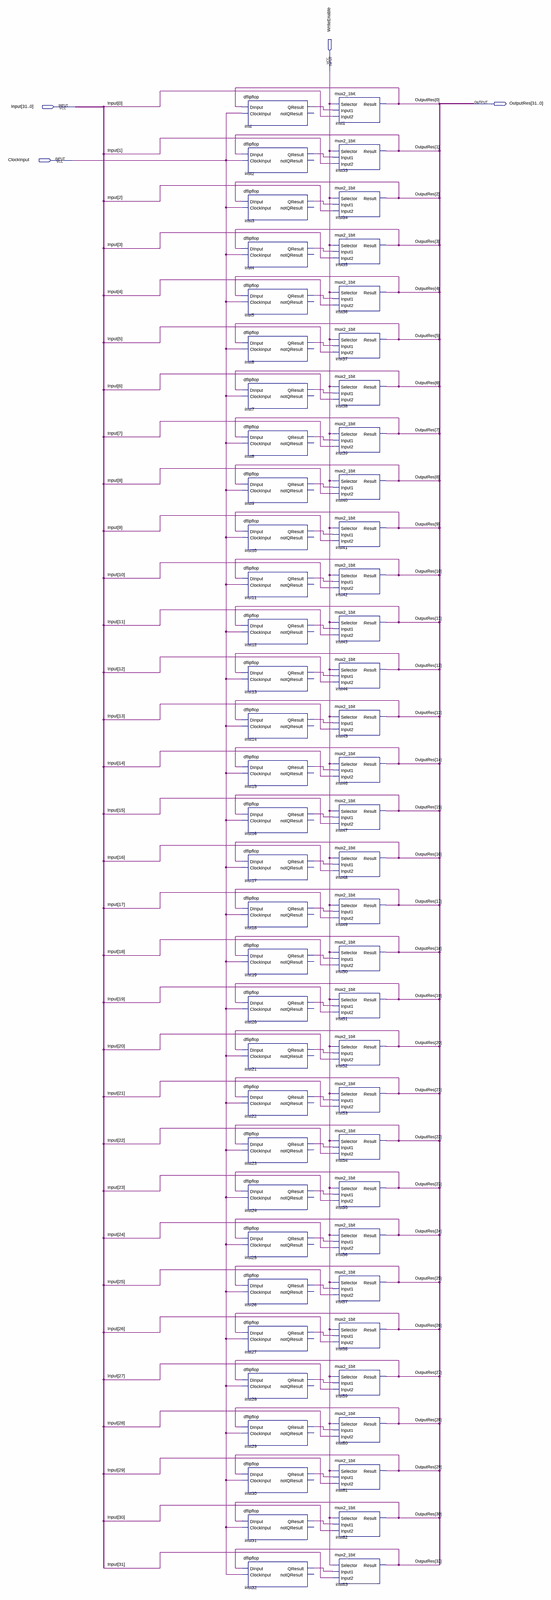
[diagram p0: schematic sheet, whole]
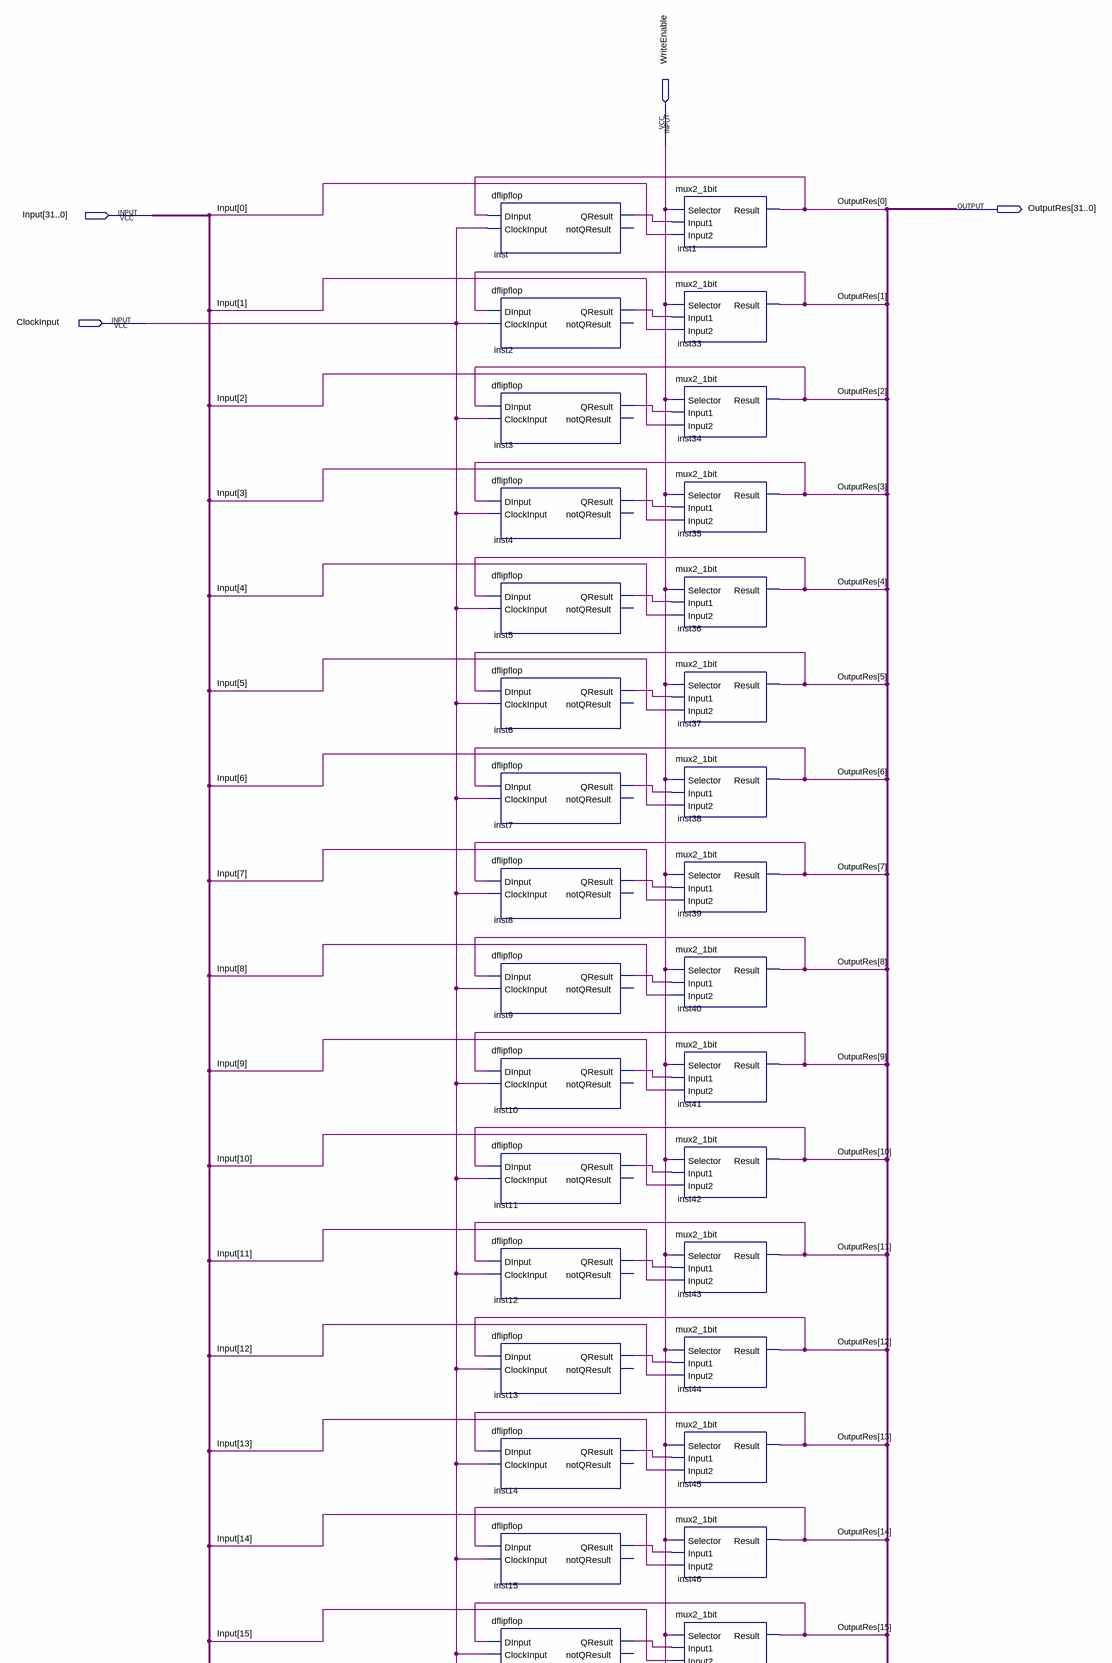
[diagram p1: schematic sheet, upper part]
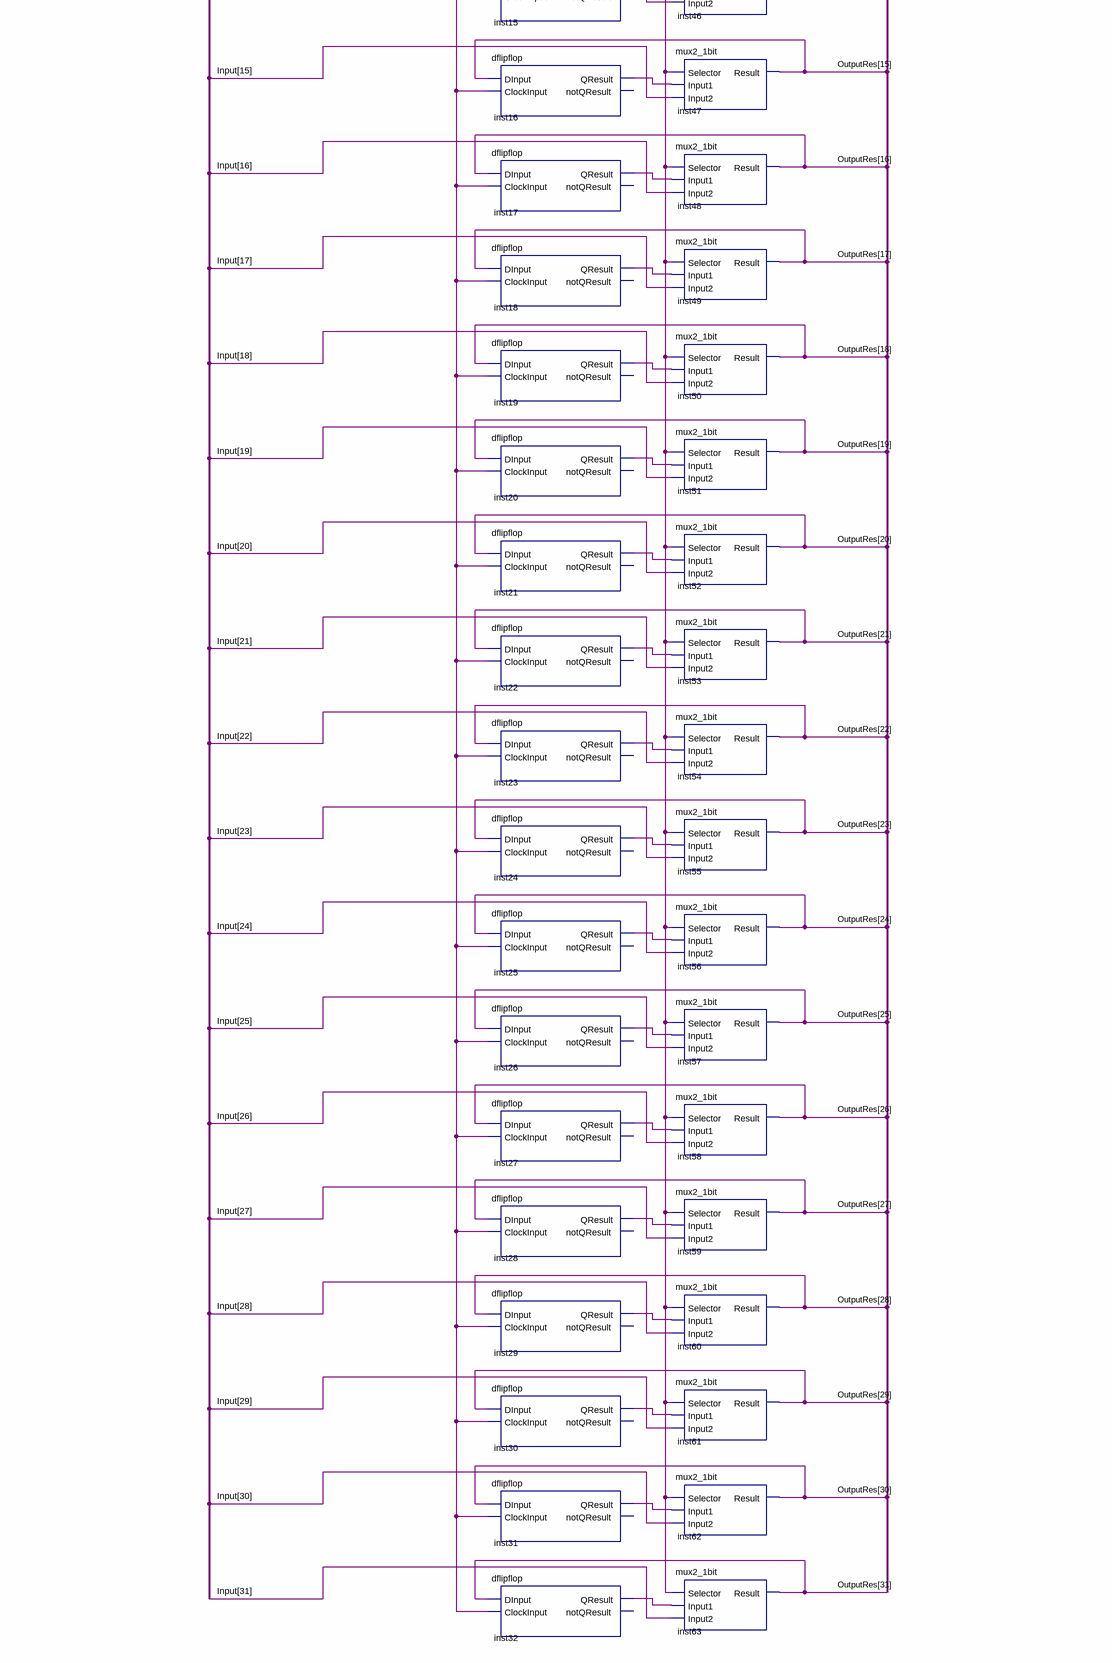
[diagram p2: schematic sheet, lower part]
// Quartus schematic writeenabledflipflop32bit.bdf as structural Verilog: 64 symbols, 4 pins
module writeenabledflipflop32bit (
  input  WriteEnable,
  input  [31:0] Input,
  input  ClockInput,
  output [31:0] OutputRes
);

  wire inst2_qresult, inst3_qresult, inst4_qresult, inst5_qresult, inst6_qresult, inst7_qresult,
       inst8_qresult, inst9_qresult, inst10_qresult, inst11_qresult, inst12_qresult, inst13_qresult,
       inst14_qresult, inst15_qresult, inst16_qresult, inst17_qresult, inst18_qresult, inst19_qresult,
       inst20_qresult, inst21_qresult, inst22_qresult, inst23_qresult, inst24_qresult, inst25_qresult,
       inst26_qresult, inst27_qresult, inst28_qresult, inst29_qresult, inst30_qresult, inst31_qresult,
       inst32_qresult, inst_qresult;

  dflipflop inst (.DInput(OutputRes[0]), .ClockInput(ClockInput), .QResult(inst_qresult));  // open: notQResult
  dflipflop inst2 (.DInput(OutputRes[1]), .ClockInput(ClockInput), .QResult(inst2_qresult));  // open: notQResult
  dflipflop inst3 (.DInput(OutputRes[2]), .ClockInput(ClockInput), .QResult(inst3_qresult));  // open: notQResult
  dflipflop inst4 (.DInput(OutputRes[3]), .ClockInput(ClockInput), .QResult(inst4_qresult));  // open: notQResult
  dflipflop inst5 (.DInput(OutputRes[4]), .ClockInput(ClockInput), .QResult(inst5_qresult));  // open: notQResult
  dflipflop inst6 (.DInput(OutputRes[5]), .ClockInput(ClockInput), .QResult(inst6_qresult));  // open: notQResult
  dflipflop inst7 (.DInput(OutputRes[6]), .ClockInput(ClockInput), .QResult(inst7_qresult));  // open: notQResult
  dflipflop inst8 (.DInput(OutputRes[7]), .ClockInput(ClockInput), .QResult(inst8_qresult));  // open: notQResult
  dflipflop inst9 (.DInput(OutputRes[8]), .ClockInput(ClockInput), .QResult(inst9_qresult));  // open: notQResult
  dflipflop inst10 (.DInput(OutputRes[9]), .ClockInput(ClockInput), .QResult(inst10_qresult));  // open: notQResult
  dflipflop inst11 (.DInput(OutputRes[10]), .ClockInput(ClockInput), .QResult(inst11_qresult));  // open: notQResult
  dflipflop inst12 (.DInput(OutputRes[11]), .ClockInput(ClockInput), .QResult(inst12_qresult));  // open: notQResult
  dflipflop inst13 (.DInput(OutputRes[12]), .ClockInput(ClockInput), .QResult(inst13_qresult));  // open: notQResult
  dflipflop inst14 (.DInput(OutputRes[13]), .ClockInput(ClockInput), .QResult(inst14_qresult));  // open: notQResult
  dflipflop inst15 (.DInput(OutputRes[14]), .ClockInput(ClockInput), .QResult(inst15_qresult));  // open: notQResult
  dflipflop inst16 (.DInput(OutputRes[15]), .ClockInput(ClockInput), .QResult(inst16_qresult));  // open: notQResult
  dflipflop inst17 (.DInput(OutputRes[16]), .ClockInput(ClockInput), .QResult(inst17_qresult));  // open: notQResult
  dflipflop inst18 (.DInput(OutputRes[17]), .ClockInput(ClockInput), .QResult(inst18_qresult));  // open: notQResult
  dflipflop inst19 (.DInput(OutputRes[18]), .ClockInput(ClockInput), .QResult(inst19_qresult));  // open: notQResult
  dflipflop inst20 (.DInput(OutputRes[19]), .ClockInput(ClockInput), .QResult(inst20_qresult));  // open: notQResult
  dflipflop inst21 (.DInput(OutputRes[20]), .ClockInput(ClockInput), .QResult(inst21_qresult));  // open: notQResult
  dflipflop inst22 (.DInput(OutputRes[21]), .ClockInput(ClockInput), .QResult(inst22_qresult));  // open: notQResult
  dflipflop inst23 (.DInput(OutputRes[22]), .ClockInput(ClockInput), .QResult(inst23_qresult));  // open: notQResult
  dflipflop inst24 (.DInput(OutputRes[23]), .ClockInput(ClockInput), .QResult(inst24_qresult));  // open: notQResult
  dflipflop inst25 (.DInput(OutputRes[24]), .ClockInput(ClockInput), .QResult(inst25_qresult));  // open: notQResult
  dflipflop inst26 (.DInput(OutputRes[25]), .ClockInput(ClockInput), .QResult(inst26_qresult));  // open: notQResult
  dflipflop inst27 (.DInput(OutputRes[26]), .ClockInput(ClockInput), .QResult(inst27_qresult));  // open: notQResult
  dflipflop inst28 (.DInput(OutputRes[27]), .ClockInput(ClockInput), .QResult(inst28_qresult));  // open: notQResult
  dflipflop inst29 (.DInput(OutputRes[28]), .ClockInput(ClockInput), .QResult(inst29_qresult));  // open: notQResult
  dflipflop inst30 (.DInput(OutputRes[29]), .ClockInput(ClockInput), .QResult(inst30_qresult));  // open: notQResult
  dflipflop inst31 (.DInput(OutputRes[30]), .ClockInput(ClockInput), .QResult(inst31_qresult));  // open: notQResult
  dflipflop inst32 (.DInput(OutputRes[31]), .ClockInput(ClockInput), .QResult(inst32_qresult));  // open: notQResult
  mux2_1bit inst1 (.Selector(WriteEnable), .Input1(inst_qresult), .Input2(Input[0]), .Result(OutputRes[0]));
  mux2_1bit inst33 (.Selector(WriteEnable), .Input1(inst2_qresult), .Input2(Input[1]), .Result(OutputRes[1]));
  mux2_1bit inst34 (.Selector(WriteEnable), .Input1(inst3_qresult), .Input2(Input[2]), .Result(OutputRes[2]));
  mux2_1bit inst35 (.Selector(WriteEnable), .Input1(inst4_qresult), .Input2(Input[3]), .Result(OutputRes[3]));
  mux2_1bit inst36 (.Selector(WriteEnable), .Input1(inst5_qresult), .Input2(Input[4]), .Result(OutputRes[4]));
  mux2_1bit inst37 (.Selector(WriteEnable), .Input1(inst6_qresult), .Input2(Input[5]), .Result(OutputRes[5]));
  mux2_1bit inst38 (.Selector(WriteEnable), .Input1(inst7_qresult), .Input2(Input[6]), .Result(OutputRes[6]));
  mux2_1bit inst39 (.Selector(WriteEnable), .Input1(inst8_qresult), .Input2(Input[7]), .Result(OutputRes[7]));
  mux2_1bit inst40 (.Selector(WriteEnable), .Input1(inst9_qresult), .Input2(Input[8]), .Result(OutputRes[8]));
  mux2_1bit inst41 (.Selector(WriteEnable), .Input1(inst10_qresult), .Input2(Input[9]), .Result(OutputRes[9]));
  mux2_1bit inst42 (.Selector(WriteEnable), .Input1(inst11_qresult), .Input2(Input[10]), .Result(OutputRes[10]));
  mux2_1bit inst43 (.Selector(WriteEnable), .Input1(inst12_qresult), .Input2(Input[11]), .Result(OutputRes[11]));
  mux2_1bit inst44 (.Selector(WriteEnable), .Input1(inst13_qresult), .Input2(Input[12]), .Result(OutputRes[12]));
  mux2_1bit inst45 (.Selector(WriteEnable), .Input1(inst14_qresult), .Input2(Input[13]), .Result(OutputRes[13]));
  mux2_1bit inst46 (.Selector(WriteEnable), .Input1(inst15_qresult), .Input2(Input[14]), .Result(OutputRes[14]));
  mux2_1bit inst47 (.Selector(WriteEnable), .Input1(inst16_qresult), .Input2(Input[15]), .Result(OutputRes[15]));
  mux2_1bit inst48 (.Selector(WriteEnable), .Input1(inst17_qresult), .Input2(Input[16]), .Result(OutputRes[16]));
  mux2_1bit inst49 (.Selector(WriteEnable), .Input1(inst18_qresult), .Input2(Input[17]), .Result(OutputRes[17]));
  mux2_1bit inst50 (.Selector(WriteEnable), .Input1(inst19_qresult), .Input2(Input[18]), .Result(OutputRes[18]));
  mux2_1bit inst51 (.Selector(WriteEnable), .Input1(inst20_qresult), .Input2(Input[19]), .Result(OutputRes[19]));
  mux2_1bit inst52 (.Selector(WriteEnable), .Input1(inst21_qresult), .Input2(Input[20]), .Result(OutputRes[20]));
  mux2_1bit inst53 (.Selector(WriteEnable), .Input1(inst22_qresult), .Input2(Input[21]), .Result(OutputRes[21]));
  mux2_1bit inst54 (.Selector(WriteEnable), .Input1(inst23_qresult), .Input2(Input[22]), .Result(OutputRes[22]));
  mux2_1bit inst55 (.Selector(WriteEnable), .Input1(inst24_qresult), .Input2(Input[23]), .Result(OutputRes[23]));
  mux2_1bit inst56 (.Selector(WriteEnable), .Input1(inst25_qresult), .Input2(Input[24]), .Result(OutputRes[24]));
  mux2_1bit inst57 (.Selector(WriteEnable), .Input1(inst26_qresult), .Input2(Input[25]), .Result(OutputRes[25]));
  mux2_1bit inst58 (.Selector(WriteEnable), .Input1(inst27_qresult), .Input2(Input[26]), .Result(OutputRes[26]));
  mux2_1bit inst59 (.Selector(WriteEnable), .Input1(inst28_qresult), .Input2(Input[27]), .Result(OutputRes[27]));
  mux2_1bit inst60 (.Selector(WriteEnable), .Input1(inst29_qresult), .Input2(Input[28]), .Result(OutputRes[28]));
  mux2_1bit inst61 (.Selector(WriteEnable), .Input1(inst30_qresult), .Input2(Input[29]), .Result(OutputRes[29]));
  mux2_1bit inst62 (.Selector(WriteEnable), .Input1(inst31_qresult), .Input2(Input[30]), .Result(OutputRes[30]));
  mux2_1bit inst63 (.Selector(WriteEnable), .Input1(inst32_qresult), .Input2(Input[31]), .Result(OutputRes[31]));
endmodule
